# Altium schematic sheet CF_ADC_filter.SchDoc
size Tabloid; DocumentNumber: 8; SheetNumber: 8; SheetTotal: 10; Sheet_Name: CF_ADC_FILTER; Size: 11x17
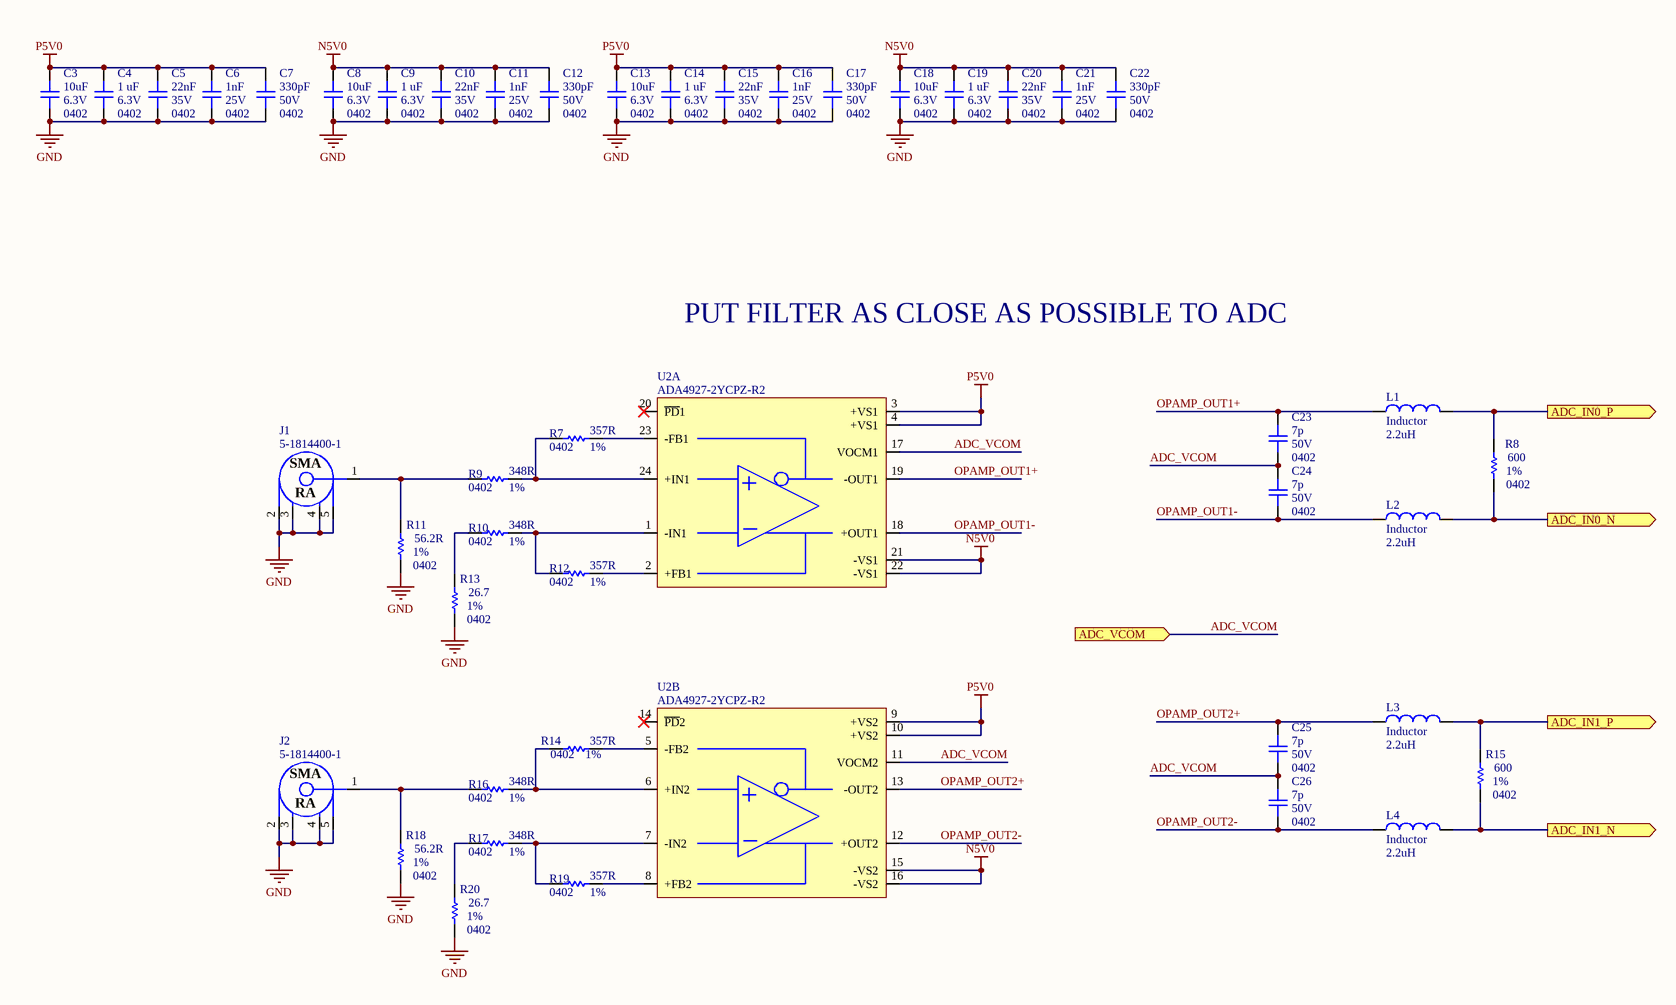
[diagram p0: CF_ADC_filter.SchDoc]

## Parts
C3  value 10uF  Voltage: 6.3V  Package: 0402  [CAP_0402]  (hidden comment: CAP - 0402)
C4  value 1 uF  Voltage: 6.3V  Package: 0402  [CAP_0402]  (hidden comment: CAP - 0402)
C5  value 22nF  Voltage: 35V  Package: 0402  [CAP_0402]  (hidden comment: CAP - 0402)
C6  value 1nF  Voltage: 25V  Package: 0402  [CAP_0402]  (hidden comment: CAP - 0402)
C7  value 330pF  Voltage: 50V  Package: 0402  [CAP_0402]  (hidden comment: CAP - 0402)
C8  value 10uF  Voltage: 6.3V  Package: 0402  [CAP_0402]  (hidden comment: CAP - 0402)
C9  value 1 uF  Voltage: 6.3V  Package: 0402  [CAP_0402]  (hidden comment: CAP - 0402)
C10  value 22nF  Voltage: 35V  Package: 0402  [CAP_0402]  (hidden comment: CAP - 0402)
C11  value 1nF  Voltage: 25V  Package: 0402  [CAP_0402]  (hidden comment: CAP - 0402)
C12  value 330pF  Voltage: 50V  Package: 0402  [CAP_0402]  (hidden comment: CAP - 0402)
C13  value 10uF  Voltage: 6.3V  Package: 0402  [CAP_0402]  (hidden comment: CAP - 0402)
C14  value 1 uF  Voltage: 6.3V  Package: 0402  [CAP_0402]  (hidden comment: CAP - 0402)
C15  value 22nF  Voltage: 35V  Package: 0402  [CAP_0402]  (hidden comment: CAP - 0402)
C16  value 1nF  Voltage: 25V  Package: 0402  [CAP_0402]  (hidden comment: CAP - 0402)
C17  value 330pF  Voltage: 50V  Package: 0402  [CAP_0402]  (hidden comment: CAP - 0402)
C18  value 10uF  Voltage: 6.3V  Package: 0402  [CAP_0402]  (hidden comment: CAP - 0402)
C19  value 1 uF  Voltage: 6.3V  Package: 0402  [CAP_0402]  (hidden comment: CAP - 0402)
C20  value 22nF  Voltage: 35V  Package: 0402  [CAP_0402]  (hidden comment: CAP - 0402)
C21  value 1nF  Voltage: 25V  Package: 0402  [CAP_0402]  (hidden comment: CAP - 0402)
C22  value 330pF  Voltage: 50V  Package: 0402  [CAP_0402]  (hidden comment: CAP - 0402)
C23  value 7p  Voltage: 50V  Package: 0402  [CAP_0402]  (hidden comment: CAP - 0402)
C24  value 7p  Voltage: 50V  Package: 0402  [CAP_0402]  (hidden comment: CAP - 0402)
C25  value 7p  Voltage: 50V  Package: 0402  [CAP_0402]  (hidden comment: CAP - 0402)
C26  value 7p  Voltage: 50V  Package: 0402  [CAP_0402]  (hidden comment: CAP - 0402)
J1  5-1814400-1  [CONN_SMA_5-1814400-1]
J2  5-1814400-1  [CONN_SMA_5-1814400-1]
L1  Inductor  value 2.2uH  [0402-A]
L2  Inductor  value 2.2uH  [0402-A]
L3  Inductor  value 2.2uH  [0402-A]
L4  Inductor  value 2.2uH  [0402-A]
R7  value 357R  Package: 0402  Precision: 1%  [RES_0402]  (hidden comment: RES - 0402)
R8  value 600  Package: 0402  Precision: 1%  [RES_0402]  (hidden comment: RES - 0402)
R9  value 348R  Package: 0402  Precision: 1%  [RES_0402]  (hidden comment: RES - 0402)
R10  value 348R  Package: 0402  Precision: 1%  [RES_0402]  (hidden comment: RES - 0402)
R11  value 56.2R  Package: 0402  Precision: 1%  [RES_0402]  (hidden comment: RES - 0402)
R12  value 357R  Package: 0402  Precision: 1%  [RES_0402]  (hidden comment: RES - 0402)
R13  value 26.7  Package: 0402  Precision: 1%  [RES_0402]  (hidden comment: RES - 0402)
R14  value 357R  Package: 0402  Precision: 1%  [RES_0402]  (hidden comment: RES - 0402)
R15  value 600  Package: 0402  Precision: 1%  [RES_0402]  (hidden comment: RES - 0402)
R16  value 348R  Package: 0402  Precision: 1%  [RES_0402]  (hidden comment: RES - 0402)
R17  value 348R  Package: 0402  Precision: 1%  [RES_0402]  (hidden comment: RES - 0402)
R18  value 56.2R  Package: 0402  Precision: 1%  [RES_0402]  (hidden comment: RES - 0402)
R19  value 357R  Package: 0402  Precision: 1%  [RES_0402]  (hidden comment: RES - 0402)
R20  value 26.7  Package: 0402  Precision: 1%  [RES_0402]  (hidden comment: RES - 0402)
U2  ADA4927-2YCPZ-R2  [OPAMP_ADA4927-2YCPZ-R2]  (parts A,B of 2)

## Ports
ADC_IN0_N (out), ADC_IN0_P (out), ADC_IN1_N (out), ADC_IN1_P (out), ADC_VCOM (in)

## Nets
GND: C3.1 C4.1 C5.1 C6.1 C7.1 C8.1 C9.1 C10.1 C11.1 C12.1 C13.1 C14.1 C15.1 C16.1 C17.1 C18.1 C19.1 C20.1 C21.1 C22.1 J1.2 J1.3 J1.4 J1.5 J2.2 J2.3 J2.4 J2.5 R11.1 R13.1 R18.1 R20.1
N5V0: C8.2 C9.2 C10.2 C11.2 C12.2 C18.2 C19.2 C20.2 C21.2 C22.2 U2.15(-VS2) U2.16(-VS2) U2.21(-VS1) U2.22(-VS1)
P5V0: C3.2 C4.2 C5.2 C6.2 C7.2 C13.2 C14.2 C15.2 C16.2 C17.2 U2.3(+VS1) U2.4(+VS1) U2.9(+VS2) U2.10(+VS2)
ADC_IN0_N: L2.2 R8.1 ; port ADC_IN0_N
ADC_IN0_P: L1.2 R8.2 ; port ADC_IN0_P
ADC_IN1_N: L4.2 R15.1 ; port ADC_IN1_N
ADC_IN1_P: L3.2 R15.2 ; port ADC_IN1_P
ADC_VCOM: C23.1 C24.2 C25.1 C26.2 U2.11(VOCM2) U2.17(VOCM1) ; port ADC_VCOM
OPAMP_OUT1+: C23.2 L1.1 U2.19(-OUT1)
OPAMP_OUT1-: C24.1 L2.1 U2.18(+OUT1)
OPAMP_OUT2+: C25.2 L3.1 U2.13(-OUT2)
OPAMP_OUT2-: C26.1 L4.1 U2.12(+OUT2)
NetJ1_1: J1.1 R9.2 R11.2
NetJ2_1: J2.1 R16.2 R18.2
NetR7_1: R7.1 U2.23(-FB1)
NetR7_2: R7.2 R9.1 U2.24(+IN1)
NetR10_1: R10.1 R12.2 U2.1(-IN1)
NetR10_2: R10.2 R13.2
NetR12_1: R12.1 U2.2(+FB1)
NetR14_1: R14.1 U2.5(-FB2)
NetR14_2: R14.2 R16.1 U2.6(+IN2)
NetR17_1: R17.1 R19.2 U2.7(-IN2)
NetR17_2: R17.2 R20.2
NetR19_1: R19.1 U2.8(+FB2)

Not connected (* = marked no-connect by the designer): U2 14(~{PD}2)* 20(~{PD}1)*

## Notes on the sheet
- PUT FILTER AS CLOSE AS POSSIBLE TO ADC
- Sheet Name
- Project Title
- Global Project
- Size
- Group
- Revision
- Date
- Sheet
- of
- Filename
- Designers
- (in symbol CONN_SMA_5-1814400-1) SMA; RA

## Library data of the parts
C3-C26 = CAP - 0402: Precision: 10%; Current: *; CreatedBy: Jonathan Bouchard; Power: *
J1 J2 = CONN_SMA_5-1814400-1: CONN -  SMA JACK R/A 50 OHM - TH; Mfg: TE Connectivity AMP Connectors; Voltage: *; Current: *; Power: *; Mfg Part Number: 5-1814400-1; HelpURL: http://www.te.com/commerce/DocumentDelivery/DDEController?Action=srchrtrv&DocNm=1814400&DocType=Customer+Drawing&DocLang=English; CreatedBy: Jonathan Bouchard; Temperature: -55°C ~ 85°C; Value: *; Precision: *; Package: TH-5; Supplier 1: Digikey; Supplier Part Number 1: A97593-ND
L1-L4 = Inductor: Code_IEC: 1005; Published: 8-Jun-2000; LatestRevisionDate: 29-May-2009; LatestRevisionNote: IPC-7351 Footprint Added.; PackageReference: 0402-A; Publisher: Altium Limited; PackageDescription: Chip Inductor; Code_JEITA: 0402
R7-R20 = RES - 0402: Voltage: 50V; Power: 1/16W; Current: *; CreatedBy: Jonathan Bouchard
U2 = OPAMP_ADA4927-2YCPZ-R2: OPAMP - CFA 2.3GHZ - QFN-24; Voltage: 4.5 V ~ 11 V, ±2.25 V ~ 5.5 V; Current: 65mA; Mfg: Analog Devices; Power: *; Mfg Part Number: ADA4927-2YCPZ-R2; HelpURL: http://www.analog.com/media/en/technical-documentation/data-sheets/ADA4927-1_4927-2.pdf; CreatedBy: Jonathan Bouchard; Temperature: -40°C ~ 105°C; Value: *; Precision: *; Package: QFN-24; Supplier 1: Digikey; Supplier Part Number 1: ADA4927-2YCPZ-R2CT-ND